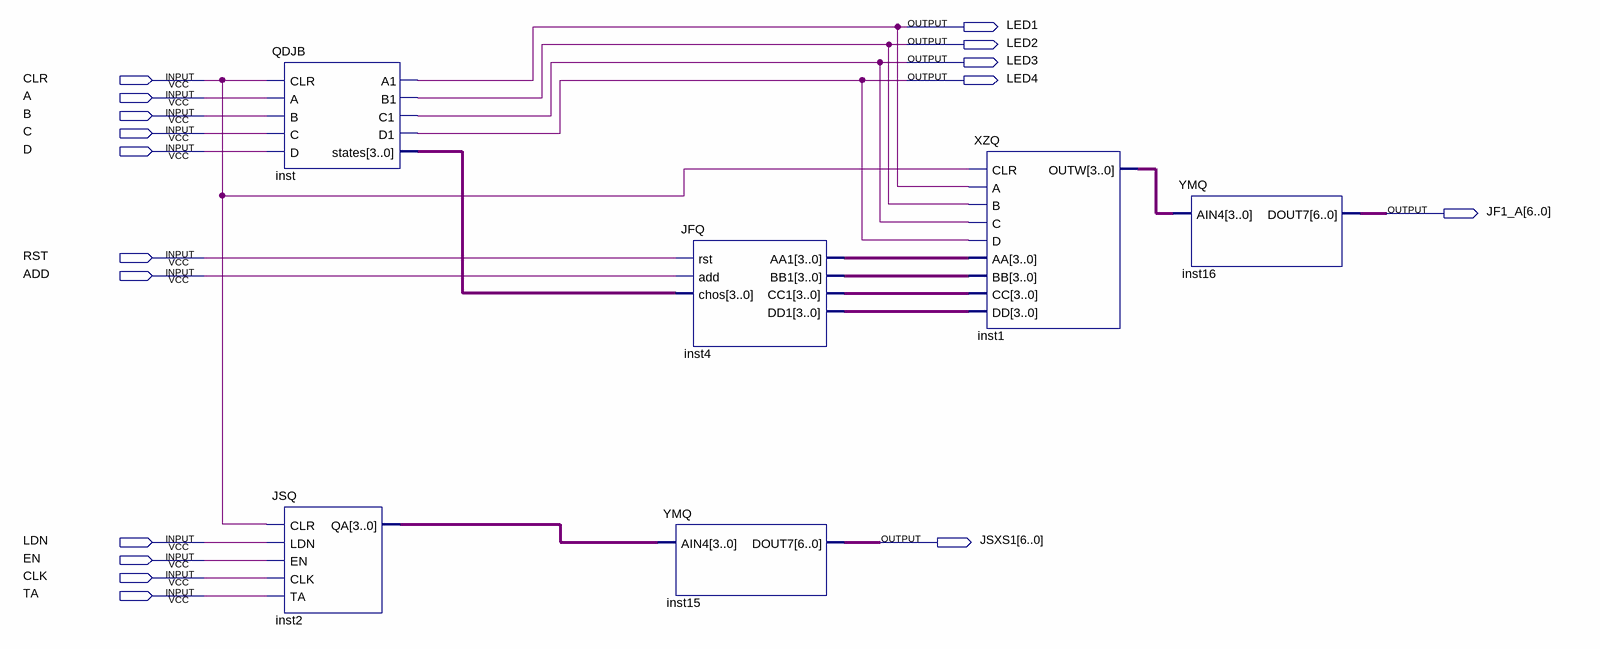
[diagram p0: schematic sheet]
// Quartus schematic Block1.bdf as structural Verilog: 6 symbols, 17 pins
module Block1 (
  input  CLR,
  input  A,
  input  B,
  input  C,
  input  D,
  input  RST,
  input  ADD,
  input  LDN,
  input  EN,
  input  CLK,
  input  TA,
  output LED1,
  output LED2,
  output LED3,
  output LED4,
  output [6:0] JF1_A,
  output [6:0] JSXS1
);

  wire [3:0] inst1_outw, inst2_qa, inst4_aa1, inst4_bb1, inst4_cc1, inst4_dd1, inst_states;

  QDJB inst (.CLR(CLR), .A(A), .B(B), .C(C), .D(D), .A1(LED1), .B1(LED2), .C1(LED3), .D1(LED4), .states(inst_states));
  JSQ inst2 (.CLR(CLR), .LDN(LDN), .EN(EN), .CLK(CLK), .TA(TA), .QA(inst2_qa));
  JFQ inst4 (
    .rst(RST), .add(ADD), .chos(inst_states), .AA1(inst4_aa1), .BB1(inst4_bb1), .CC1(inst4_cc1),
    .DD1(inst4_dd1));
  YMQ inst15 (.AIN4(inst2_qa), .DOUT7(JSXS1));
  XZQ inst1 (
    .CLR(CLR), .A(LED1), .B(LED2), .C(LED3), .D(LED4), .AA(inst4_aa1), .BB(inst4_bb1), .CC(inst4_cc1),
    .DD(inst4_dd1), .OUTW(inst1_outw));
  YMQ inst16 (.AIN4(inst1_outw), .DOUT7(JF1_A));
endmodule
